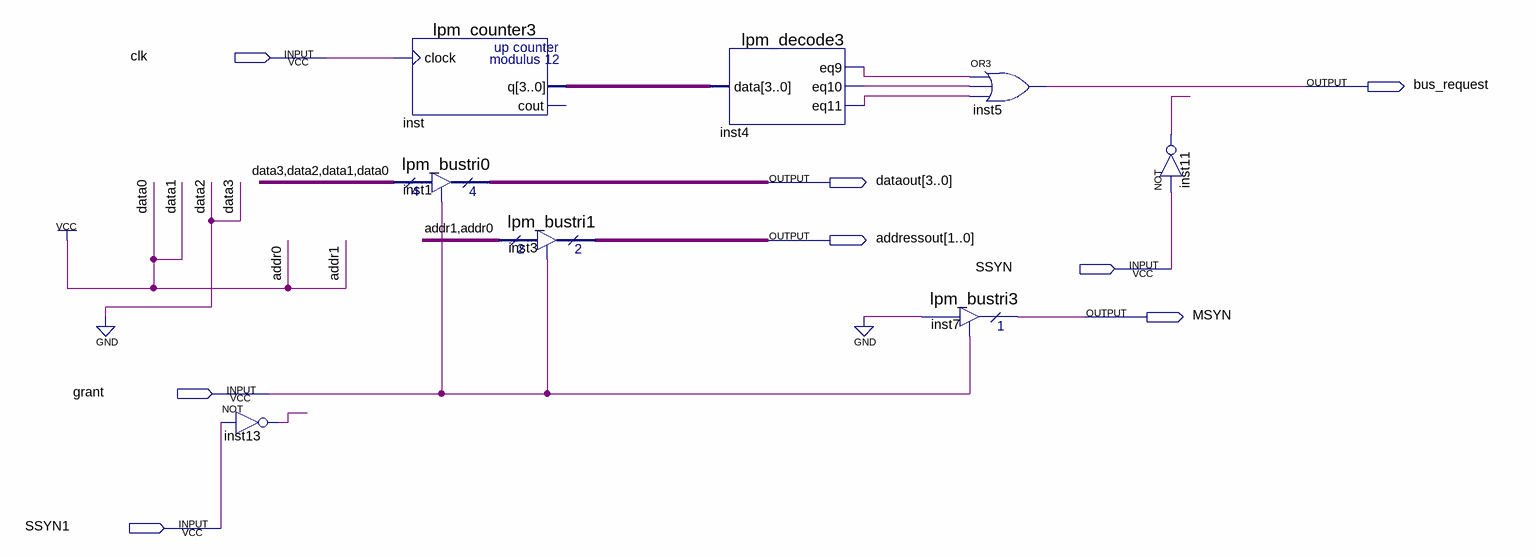
[diagram p0: schematic sheet]
// Quartus schematic master3.bdf as structural Verilog: 8 symbols, 8 pins
module master3 (
  input  clk,
  input  SSYN,
  input  grant,
  input  SSYN1,
  output bus_request,
  output [3:0] dataout,
  output [1:0] addressout,
  output MSYN
);

  wire inst4_eq9, inst4_eq10, inst4_eq11, inst11_out, inst13_out;
  wire [3:0] inst_q;

  not inst13 (inst13_out, SSYN1);
  lpm_counter3 inst (.clock(clk), .q(inst_q));  // open: cout
  lpm_bustri0 inst1 (.enabledt(grant), .data(4'b0011), .tridata(dataout));
  lpm_bustri1 inst3 (.enabledt(grant), .data(2'b11), .tridata(addressout));
  lpm_decode3 inst4 (.data(inst_q), .eq9(inst4_eq9), .eq10(inst4_eq10), .eq11(inst4_eq11));
  or inst5 (bus_request, inst4_eq9, inst4_eq10, inst4_eq11);
  lpm_bustri3 inst7 (.enabledt(grant), .data(1'b0), .tridata(MSYN));
  not inst11 (inst11_out, SSYN);
endmodule
